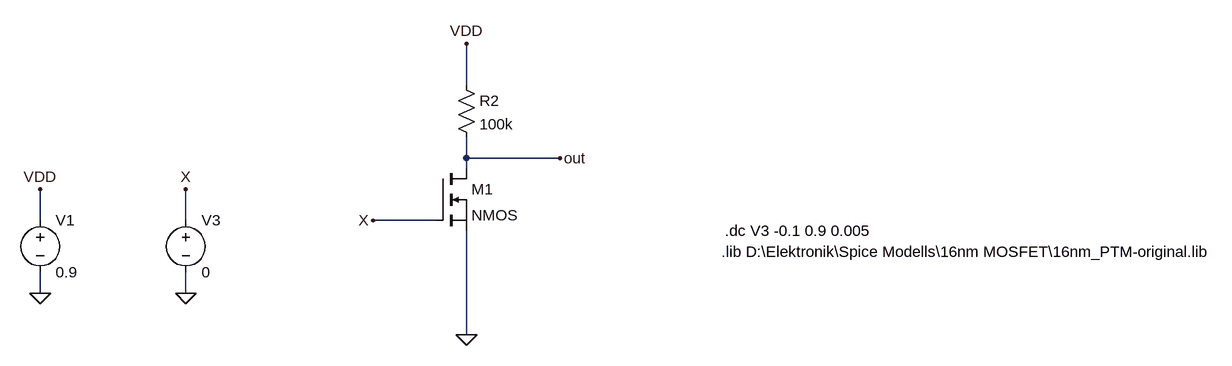
[diagram p0: schematic test.asc]
test.asc, the LTspice schematic file:
Version 4
SHEET 1 1664 680
WIRE 368 -144 368 -208
WIRE 368 -32 368 -64
WIRE 512 -32 368 -32
WIRE 368 -16 368 -32
WIRE -288 64 -288 16
WIRE -64 64 -64 16
WIRE 320 64 224 64
WIRE -288 176 -288 144
WIRE -64 176 -64 144
WIRE 368 240 368 80
FLAG 368 240 0
FLAG -288 176 0
FLAG -64 176 0
FLAG -288 16 VDD
FLAG -64 16 X
FLAG 368 -208 VDD
FLAG 224 64 X
FLAG 512 -32 out
SYMBOL voltage -288 48 R0
SYMATTR InstName V1
SYMATTR Value 0.9
SYMBOL voltage -64 48 R0
WINDOW 123 0 0 Left 2
WINDOW 39 0 0 Left 2
SYMATTR InstName V3
SYMATTR Value 0
SYMBOL res 352 -160 R0
SYMATTR InstName R2
SYMATTR Value 100k
SYMBOL nmos 320 -16 R0
SYMATTR InstName M1
TEXT 766 80 Left 2 !.dc V3 -0.1 0.9 0.005
TEXT 760 112 Left 2 !.lib D:\\Elektronik\\Spice Modells\\16nm MOSFET\\16nm_PTM-original.lib

The netlist it stands for:
* test.asc
V1 VDD 0 0.9
V3 X 0 0
R2 VDD out 100k
M1 out X 0 0 NMOS
.model NMOS NMOS
.model PMOS PMOS
.lib standard.mos
.dc V3 -0.1 0.9 0.005
.lib D:\Elektronik\Spice Modells\16nm MOSFET\16nm_PTM-original.lib
.backanno
.end

* Results of the author's LTspice run, read from the files saved beside the schematic
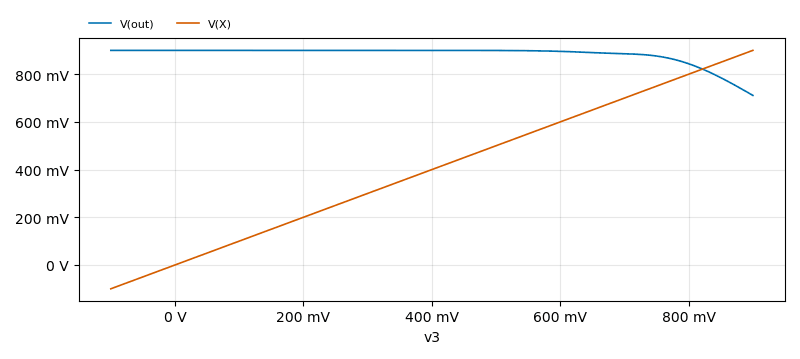
[diagram p1: DC transfer characteristic of test.asc, plotted from the saved traces]
* DC transfer characteristic, 1 run:
*   V(out): 900 mV at v3=-100 mV, 711.1 mV at v3=900 mV, min 711.1 mV, max 900 mV
*   V(X): -100 mV at v3=-100 mV, 900 mV at v3=900 mV, min -100 mV, max 900 mV